# Altium project Mach_driver.PrjPcb
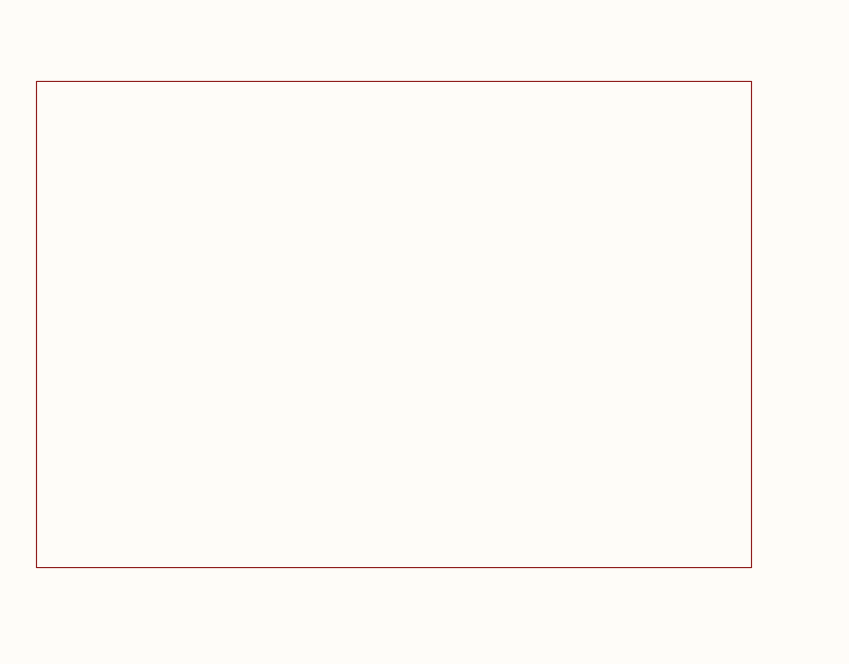
[diagram p0: Mach_driver.SchDoc, left]
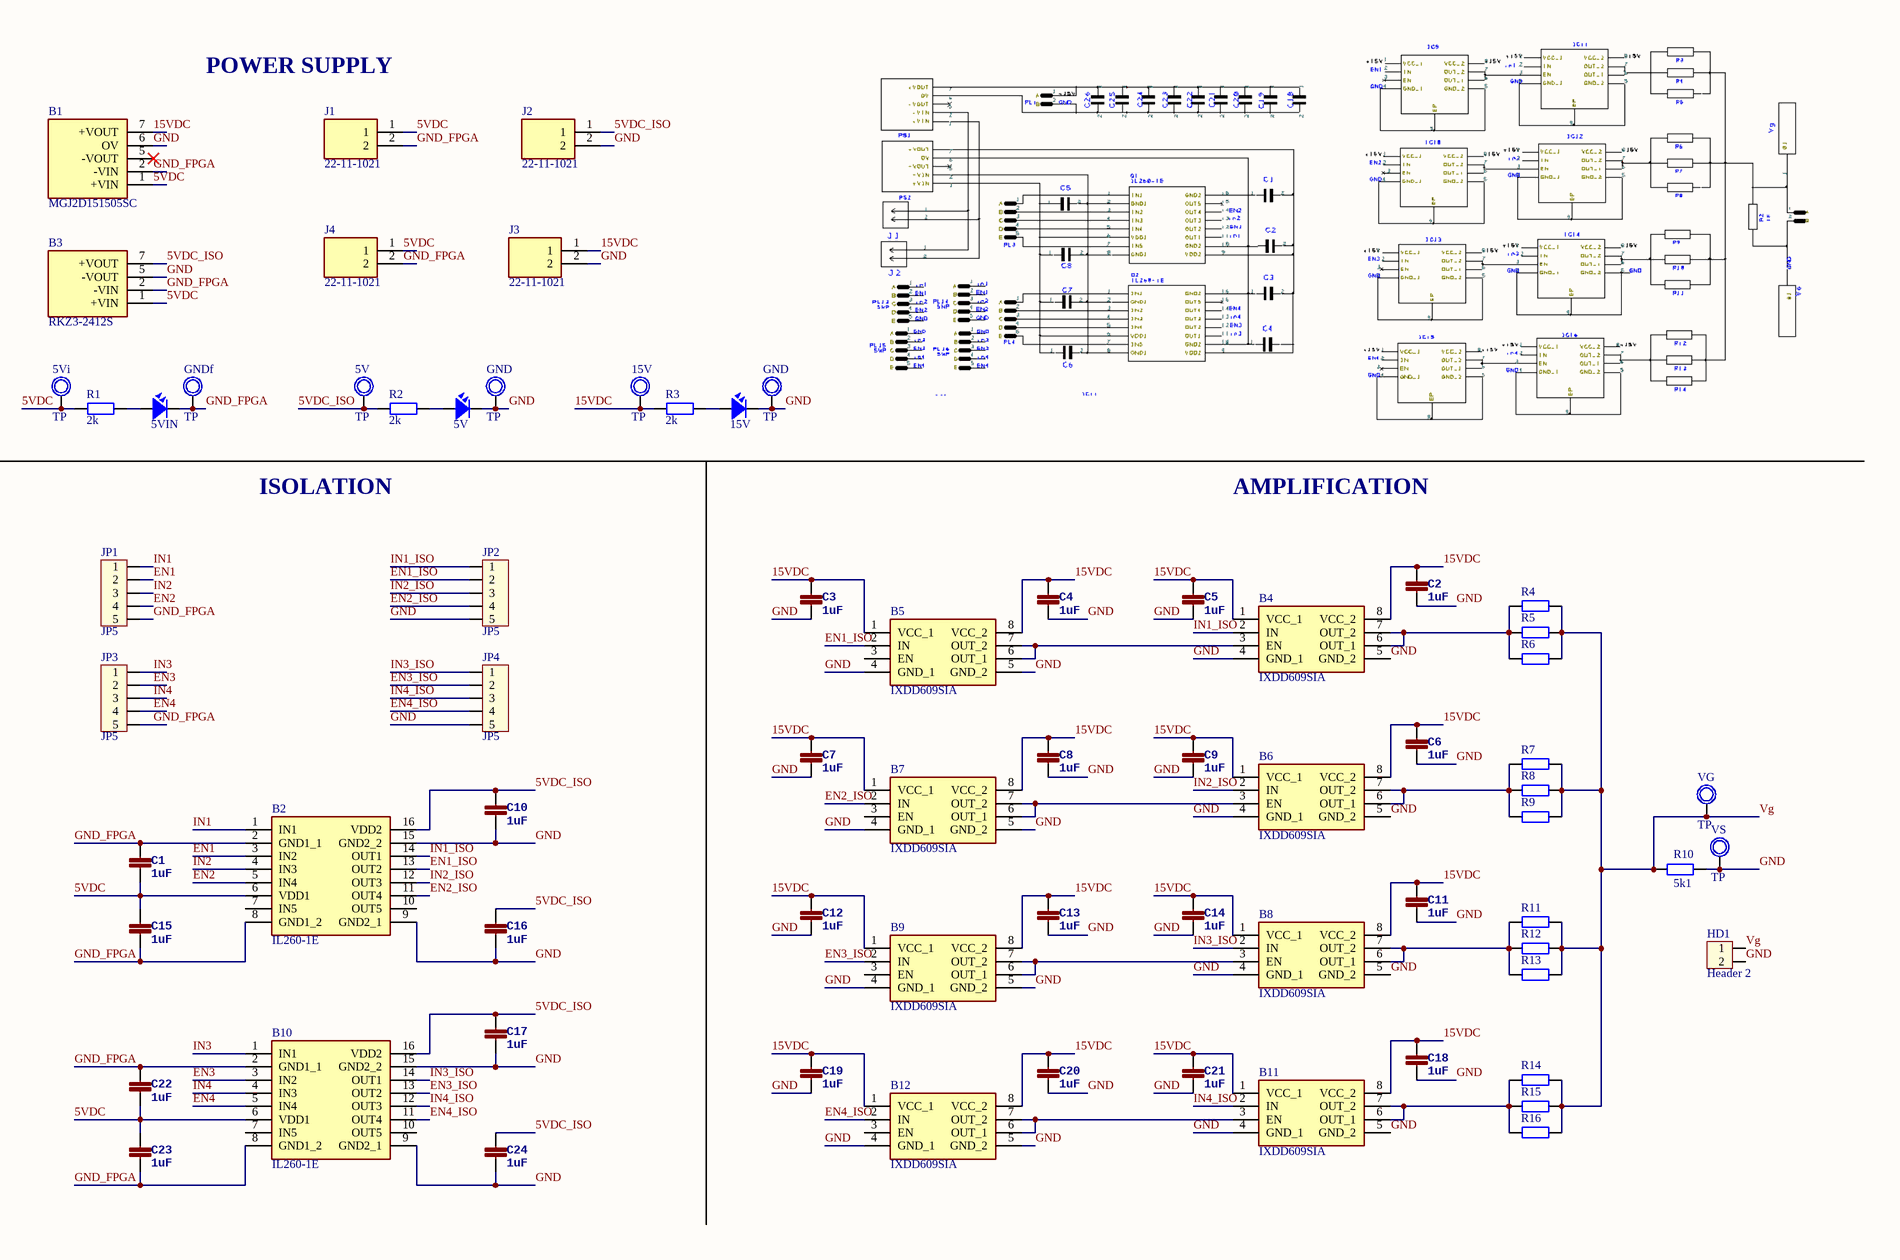
[diagram p1: Mach_driver.SchDoc, right]
1 sheet, 72 parts. Net scope: global (net labels, ports and power ports of the same name join across sheets).
Board file: Mach_driver.PcbDoc

## Sheet Mach_driver.SchDoc
size 381 x 241 mm; SheetNumber: 1; SheetTotal: 1

### Parts
(Parts that share a designator on the sheet are numbered #1, #2 ... from top to bottom, then left to right.)
5V#1  TP  [TP1]
5V#2  LED SMD  [SM-LED-1206-Blue]  (value not drawn)
5Vi  TP  [TP1]
5VIN  LED SMD  [SM-LED-1206-Blue]  (value not drawn)
15V#1  TP  [TP1]
15V#2  LED SMD  [SM-LED-1206-Blue]  (value not drawn)
B1  MGJ2D151505SC  [MGJ2D151505SC]
B2  IL260-1E  [SOP64P600X175-16N]
B3  RKZ3-2412S  [RKZ32412S]
B4  IXDD609SIA  [SOIC127P600X175-8N]
B5  IXDD609SIA  [SOIC127P600X175-8N]
B6  IXDD609SIA  [SOIC127P600X175-8N]
B7  IXDD609SIA  [SOIC127P600X175-8N]
B8  IXDD609SIA  [SOIC127P600X175-8N]
B9  IXDD609SIA  [SOIC127P600X175-8N]
B10  IL260-1E  [SOP64P600X175-16N]
B11  IXDD609SIA  [SOIC127P600X175-8N]
B12  IXDD609SIA  [SOIC127P600X175-8N]
C1  1uF  [SM-0805]
C2  1uF  [SM-0805]
C3  1uF  [SM-0805]
C4  1uF  [SM-0805]
C5  1uF  [SM-0805]
C6  1uF  [SM-0805]
C7  1uF  [SM-0805]
C8  1uF  [SM-0805]
C9  1uF  [SM-0805]
C10  1uF  [SM-0805]
C11  1uF  [SM-0805]
C12  1uF  [SM-0805]
C13  1uF  [SM-0805]
C14  1uF  [SM-0805]
C15  1uF  [SM-0805]
C16  1uF  [SM-0805]
C17  1uF  [SM-0805]
C18  1uF  [SM-0805]
C19  1uF  [SM-0805]
C20  1uF  [SM-0805]
C21  1uF  [SM-0805]
C22  1uF  [SM-0805]
C23  1uF  [SM-0805]
C24  1uF  [SM-0805]
GND#1  TP  [TP1]
GND#2  TP  [TP1]
GNDf  TP  [TP1]
HD1  Header 2  [HED2]
J1  22-11-1021  [HDRV2W64P0X250_1X2_450X490X1105P]
J2  22-11-1021  [HDRV2W64P0X250_1X2_450X490X1105P]
J3  22-11-1021  [HDRV2W64P0X250_1X2_450X490X1105P]
J4  22-11-1021  [HDRV2W64P0X250_1X2_450X490X1105P]
JP1  JP5  [CON5]
JP2  JP5  [CON5]
JP3  JP5  [CON5]
JP4  JP5  [CON5]
R1  2k  [SM-1206]
R2  2k  [SM-1206]
R3  2k  [SM-1206]
R4  1K  [SM-1206]  (value not drawn)
R5  1K  [SM-1206]  (value not drawn)
R6  1K  [SM-1206]  (value not drawn)
R7  1K  [SM-1206]  (value not drawn)
R8  1K  [SM-1206]  (value not drawn)
R9  1K  [SM-1206]  (value not drawn)
R10  5k1  [SM-1206]
R11  1K  [SM-1206]  (value not drawn)
R12  1K  [SM-1206]  (value not drawn)
R13  1K  [SM-1206]  (value not drawn)
R14  1K  [SM-1206]  (value not drawn)
R15  1K  [SM-1206]  (value not drawn)
R16  1K  [SM-1206]  (value not drawn)
VG  TP  [TP1]
VS  TP  [TP1]

### Nets
5VDC: 5Vi.1 B1.1(+VIN) B2.6(VDD1) B3.1(+VIN) B10.6(VDD1) C1.2 C15.1 C22.2 C23.1 J1.1 J4.1 R1.1
5VDC_ISO: 5V#1.1 B2.16(VDD2) B3.7(+VOUT) B10.16(VDD2) C10.1 C16.1 C17.1 C24.1 J2.1 R2.1
15VDC: 15V#1.1 B1.7(+VOUT) B4.1(VCC_1) B4.8(VCC_2) B5.1(VCC_1) B5.8(VCC_2) B6.1(VCC_1) B6.8(VCC_2) B7.1(VCC_1) B7.8(VCC_2) B8.1(VCC_1) B8.8(VCC_2) B9.1(VCC_1) B9.8(VCC_2) B11.1(VCC_1) B11.8(VCC_2) B12.1(VCC_1) B12.8(VCC_2) C2.1 C3.1 C4.1 C5.1 C6.1 C7.1 C8.1 C9.1 C11.1 C12.1 C13.1 C14.1 C18.1 C19.1 C20.1 C21.1 J3.1 R3.1
EN1: B2.3(IN2) JP1.2
EN1_ISO: B2.13(OUT2) B5.2(IN) JP2.2
EN2: B2.5(IN4) JP1.4
EN2_ISO: B2.11(OUT4) B7.2(IN) JP2.4
EN3: B10.3(IN2) JP3.2
EN3_ISO: B9.2(IN) B10.13(OUT2) JP4.2
EN4: B10.5(IN4) JP3.4
EN4_ISO: B10.11(OUT4) B12.2(IN) JP4.4
GND: 5V#2.2 15V#2.2 B1.6(OV) B2.9(GND2_1) B2.15(GND2_2) B3.5(-VOUT) B4.4(GND_1) B4.5(GND_2) B5.4(GND_1) B5.5(GND_2) B6.4(GND_1) B6.5(GND_2) B7.4(GND_1) B7.5(GND_2) B8.4(GND_1) B8.5(GND_2) B9.4(GND_1) B9.5(GND_2) B10.9(GND2_1) B10.15(GND2_2) B11.4(GND_1) B11.5(GND_2) B12.4(GND_1) B12.5(GND_2) C2.2 C3.2 C4.2 C5.2 C6.2 C7.2 C8.2 C9.2 C10.2 C11.2 C12.2 C13.2 C14.2 C16.2 C17.2 C18.2 C19.2 C20.2 C21.2 C24.2 GND#1.1 GND#2.1 HD1.2 J2.2 J3.2 JP2.5 JP4.5 R10.1 VS.1
GND_FPGA: 5VIN.2 B1.2(-VIN) B2.2(GND1_1) B2.8(GND1_2) B3.2(-VIN) B10.2(GND1_1) B10.8(GND1_2) C1.1 C15.2 C22.1 C23.2 GNDf.1 J1.2 J4.2 JP1.5 JP3.5
IN1: B2.1(IN1) JP1.1
IN1_ISO: B2.14(OUT1) B4.2(IN) JP2.1
IN2: B2.4(IN3) JP1.3
IN2_ISO: B2.12(OUT3) B6.2(IN) JP2.3
IN3: B10.1(IN1) JP3.1
IN3_ISO: B8.2(IN) B10.14(OUT1) JP4.1
IN4: B10.4(IN3) JP3.3
IN4_ISO: B10.12(OUT3) B11.2(IN) JP4.3
Vg: HD1.1 R4.2 R5.2 R6.2 R7.2 R8.2 R9.2 R10.2 R11.2 R12.2 R13.2 R14.2 R15.2 R16.2 VG.1
Net5V#2_1: 5V#2.1 R2.2
Net5VIN_1: 5VIN.1 R1.2
Net15V#2_1: 15V#2.1 R3.2
NetB4_3: B4.3(EN) B5.6(OUT_1) B5.7(OUT_2)
NetB4_6: B4.6(OUT_1) B4.7(OUT_2) R4.1 R5.1 R6.1
NetB6_3: B6.3(EN) B7.6(OUT_1) B7.7(OUT_2)
NetB6_6: B6.6(OUT_1) B6.7(OUT_2) R7.1 R8.1 R9.1
NetB8_3: B8.3(EN) B9.6(OUT_1) B9.7(OUT_2)
NetB8_6: B8.6(OUT_1) B8.7(OUT_2) R11.1 R12.1 R13.1
NetB11_3: B11.3(EN) B12.6(OUT_1) B12.7(OUT_2)
NetB11_6: B11.6(OUT_1) B11.7(OUT_2) R14.1 R15.1 R16.1

Not connected (* = marked no-connect by the designer): B1 5(-VOUT)*; B2 7(IN5) 10(OUT5); B5 3(EN); B7 3(EN); B9 3(EN); B10 7(IN5) 10(OUT5); B12 3(EN)

### Notes on the sheet
- POWER SUPPLY
- ISOLATION
- AMPLIFICATION

### Library data of the parts
5V#1 5Vi 15V#1 GND#1 GND#2 GNDf VG VS = TP1: Test Point; Value: Test Point
5V#2 5VIN 15V#2 = LED-SMD-1206
B1 = MGJ2D151505SC: DC/DC Converters; Manufacturer_Name: Murata Electronics; Geometry.Height: 12.75mm; RS Part Number: 8163516P; RS Price/Stock: http://uk.rs-online.com/web/p/products/8163516P; Manufacturer_Part_Number: MGJ2D151505SC; Datasheet Link: http://uk.rs-online.com/web/p/products/8163516P
B2 B10 = IL260-1E: High Speed Five-Channel Digital Isolator, 110Mbps, unidirectional; Manufacturer_Name: NVE; Geometry.Height: 1.75mm; RS Part Number: *; RS Price/Stock: *; Manufacturer_Part_Number: IL260-1E; Datasheet Link: https://www.nve.com/Downloads/il260-1.pdf
B3 = RKZ3-2412S: Isolated DC/DC Converters 3W 24Vin 12Vout 250mA SIP7; Manufacturer_Name: RECOM Power; Geometry.Height: 12.2mm; RS Part Number: 1655090P; RS Price/Stock: http://uk.rs-online.com/web/p/products/1655090P; Manufacturer_Part_Number: RKZ3-2412S; Datasheet Link: http://uk.rs-online.com/web/p/products/1655090P
B4-B9 B11 B12 = IXDD609SIA: Gate Drivers 9-Ampere Low-Side Ultrafast MOSFET; Manufacturer_Name: LITTELFUSE; Geometry.Height: 1.75mm; RS Part Number: *; RS Price/Stock: *; Manufacturer_Part_Number: IXDD609SIA; Datasheet Link: http://www.ixysic.com/home/pdfs.nsf/www/IXD_609.pdf/$file/IXD_609.pdf
C1-C24 = C0805: CapacitorStandard 0805 ceramic capacitor
HD1 = Hed2: Header 2 (Green); Value: Header 2
J1-J4 = 22-11-1021: Headers & Wire Housings KK2.5MM FL WAF.ASS. GOLD 504502AG; Manufacturer_Name: Molex; Allied_Number: 70777791; Geometry.Height: 11.05mm; RS Part Number: *; RS Price/Stock: *; Manufacturer_Part_Number: 22-11-1021; Datasheet Link: https://www.molex.com/pdm_docs/sd/022111021_sd.pdf
JP1-JP4 = Con5: Connector 5; Value: Connector 5
R1-R3 R10 = RM: Resistor SMD; Value: 1K
R4-R9 R11-R16 = RM: Resistor SMD; Value: 1K